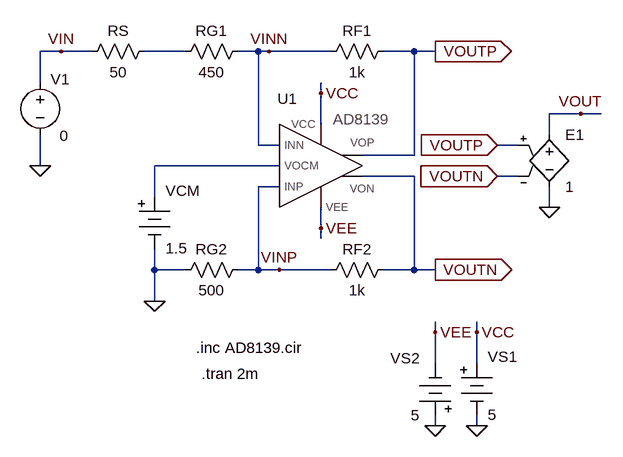
[diagram p0: schematic fig-02-05-21.asc]
fig-02-05-21.asc, the LTspice schematic file:
Version 4
SHEET 1 1332 680
WIRE -144 -128 -176 -128
WIRE -96 -128 -144 -128
WIRE 48 -128 -16 -128
WIRE 160 -128 128 -128
WIRE 176 -128 160 -128
WIRE 272 -128 176 -128
WIRE 400 -128 352 -128
WIRE 432 -128 400 -128
WIRE -176 -80 -176 -128
WIRE 256 -64 256 -80
WIRE 656 -32 608 -32
WIRE 688 -32 656 -32
WIRE 256 -16 256 -64
WIRE 608 0 608 -32
WIRE 160 16 160 -128
WIRE 192 16 160 16
WIRE 560 16 528 16
WIRE 400 32 400 -128
WIRE 400 32 320 32
WIRE -176 48 -176 0
WIRE 192 48 0 48
WIRE 400 64 320 64
WIRE 560 64 528 64
WIRE 192 80 160 80
WIRE 0 96 0 48
WIRE 608 112 608 80
WIRE 256 144 256 112
WIRE 256 160 256 144
WIRE 0 208 0 176
WIRE 48 208 0 208
WIRE 160 208 160 80
WIRE 160 208 128 208
WIRE 192 208 160 208
WIRE 272 208 192 208
WIRE 400 208 400 64
WIRE 400 208 352 208
WIRE 432 208 400 208
WIRE 0 256 0 208
WIRE 432 304 432 288
WIRE 496 304 496 288
WIRE 432 352 432 304
WIRE 496 352 496 304
WIRE 432 448 432 432
WIRE 496 448 496 432
FLAG -176 48 0
FLAG 432 -128 VOUTP
IOPIN 432 -128 Out
FLAG 0 256 0
FLAG 432 448 0
FLAG 496 448 0
FLAG 432 304 VEE
FLAG 496 304 VCC
FLAG 256 -64 VCC
FLAG 256 144 VEE
FLAG 432 208 VOUTN
IOPIN 432 208 Out
FLAG 608 112 0
FLAG 528 64 VOUTN
IOPIN 528 64 In
FLAG 528 16 VOUTP
IOPIN 528 16 In
FLAG 656 -32 VOUT
FLAG -144 -128 VIN
FLAG 176 -128 VINN
FLAG 192 208 VINP
SYMBOL res 368 -144 R90
WINDOW 0 0 56 VBottom 2
WINDOW 3 32 56 VTop 2
SYMATTR InstName RF1
SYMATTR Value 1k
SYMBOL res 144 -144 R90
WINDOW 0 0 56 VBottom 2
WINDOW 3 32 56 VTop 2
SYMATTR InstName RG1
SYMATTR Value 450
SYMBOL voltage -176 -96 R0
WINDOW 0 31 26 Bottom 2
WINDOW 3 37 113 Bottom 2
WINDOW 123 35 89 Top 2
WINDOW 39 0 0 Left 0
SYMATTR InstName V1
SYMATTR Value 0
SYMBOL Misc\\battery 496 336 R0
WINDOW 0 17 6 Left 2
WINDOW 3 17 95 Left 2
WINDOW 123 0 0 Left 0
WINDOW 39 0 0 Left 0
SYMATTR InstName VS1
SYMATTR Value 5
SYMBOL Misc\\battery 432 448 R180
WINDOW 0 24 104 Left 2
WINDOW 3 24 16 Left 2
WINDOW 123 0 0 Left 0
WINDOW 39 0 0 Left 0
SYMATTR InstName VS2
SYMATTR Value 5
SYMBOL AD8139-sub 256 48 R0
WINDOW 0 -51 -88 Bottom 2
SYMATTR InstName U1
SYMATTR Value AD8139
SYMATTR Prefix X
SYMBOL res 368 192 R90
WINDOW 0 0 56 VBottom 2
WINDOW 3 32 56 VTop 2
SYMATTR InstName RF2
SYMATTR Value 1k
SYMBOL res 144 192 R90
WINDOW 0 0 56 VBottom 2
WINDOW 3 32 56 VTop 2
SYMATTR InstName RG2
SYMATTR Value 500
SYMBOL Misc\\battery 0 80 R0
WINDOW 0 17 6 Left 2
WINDOW 3 17 95 Left 2
WINDOW 123 0 0 Left 0
WINDOW 39 0 0 Left 0
SYMATTR InstName VCM
SYMATTR Value 1.5
SYMBOL res 0 -144 R90
WINDOW 0 0 56 VBottom 2
WINDOW 3 32 56 VTop 2
SYMATTR InstName RS
SYMATTR Value 50
SYMBOL e 608 -16 R0
SYMATTR InstName E1
SYMATTR Value 1
TEXT 64 328 Left 2 !.inc AD8139.cir
TEXT 72 368 Left 2 !.tran 2m

The netlist it stands for:
* fig-02-05-21.asc
RF1 VOUTP VINN 1k
RG1 VINN N001 450
V1 VIN 0 0
VS1 VCC 0 5
VS2 0 VEE 5
XU1 VINN N002 VCC VOUTP VOUTN VEE VINP AD8139-sub params: AD8139  ; pins INN VOCM VCC VOP VON VEE INP
RF2 VOUTN VINP 1k
RG2 VINP 0 500
VCM N002 0 1.5
RS N001 VIN 50
E1 VOUT 0 VOUTP VOUTN 1
.inc AD8139.cir
.tran 2m
.backanno
.end